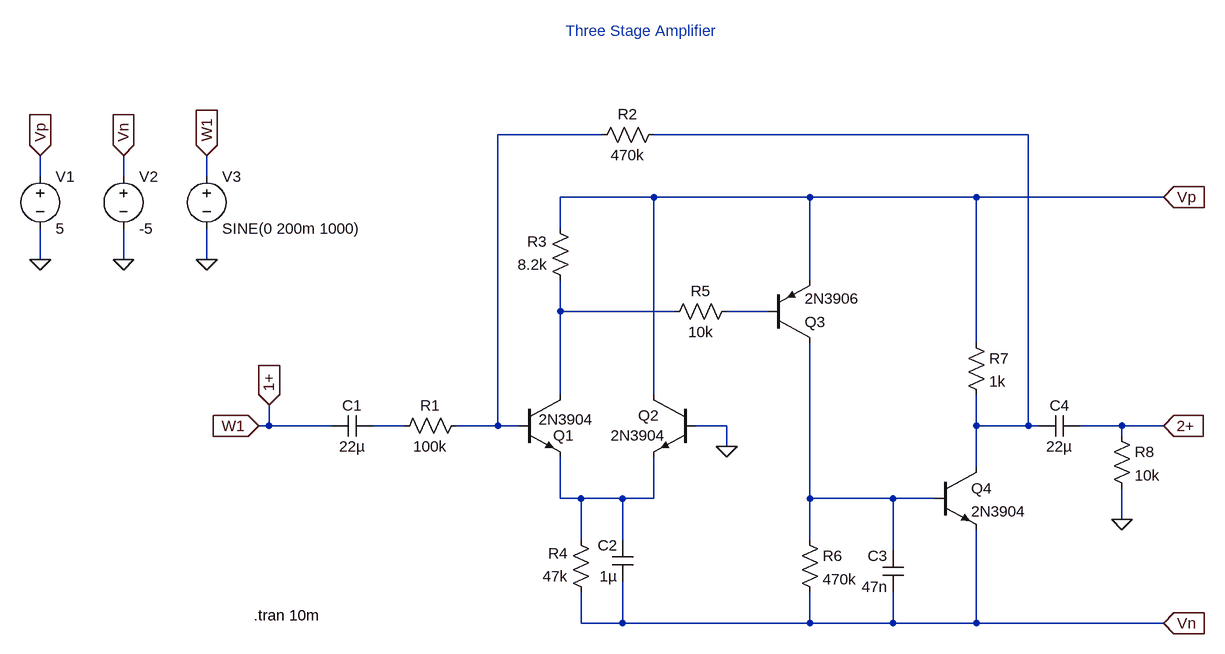
[diagram p0: schematic three_stage_amp_ltspice.asc]
three_stage_amp_ltspice.asc, the LTspice schematic file:
Version 4
SHEET 1 1400 680
WIRE 288 -320 128 -320
WIRE 944 -320 368 -320
WIRE -576 -256 -576 -288
WIRE -448 -256 -448 -288
WIRE -320 -256 -320 -288
WIRE 368 -224 224 -224
WIRE 608 -224 368 -224
WIRE 864 -224 608 -224
WIRE 1152 -224 864 -224
WIRE 224 -176 224 -224
WIRE -576 -128 -576 -176
WIRE -448 -128 -448 -176
WIRE -320 -128 -320 -176
WIRE 608 -96 608 -224
WIRE 224 -48 224 -96
WIRE 400 -48 224 -48
WIRE 544 -48 480 -48
WIRE 864 0 864 -224
WIRE 224 80 224 -48
WIRE 368 80 368 -224
WIRE -224 128 -224 96
WIRE -224 128 -240 128
WIRE -128 128 -224 128
WIRE -16 128 -64 128
WIRE 128 128 128 -320
WIRE 128 128 64 128
WIRE 160 128 128 128
WIRE 480 128 432 128
WIRE 864 128 864 80
WIRE 944 128 944 -320
WIRE 944 128 864 128
WIRE 960 128 944 128
WIRE 1088 128 1024 128
WIRE 1152 128 1088 128
WIRE 1088 144 1088 128
WIRE 480 160 480 128
WIRE 864 192 864 128
WIRE 224 240 224 176
WIRE 256 240 224 240
WIRE 320 240 256 240
WIRE 368 240 368 176
WIRE 368 240 320 240
WIRE 608 240 608 0
WIRE 736 240 608 240
WIRE 800 240 736 240
WIRE 1088 272 1088 224
WIRE 256 304 256 240
WIRE 320 304 320 240
WIRE 608 304 608 240
WIRE 736 320 736 240
WIRE 256 432 256 384
WIRE 320 432 320 368
WIRE 320 432 256 432
WIRE 608 432 608 384
WIRE 608 432 320 432
WIRE 736 432 736 384
WIRE 736 432 608 432
WIRE 864 432 864 288
WIRE 864 432 736 432
WIRE 1152 432 864 432
FLAG 480 160 0
FLAG 1088 272 0
FLAG -240 128 W1
IOPIN -240 128 In
FLAG 1152 -224 Vp
IOPIN 1152 -224 In
FLAG 1152 128 2+
IOPIN 1152 128 In
FLAG 1152 432 Vn
IOPIN 1152 432 In
FLAG -224 96 1+
IOPIN -224 96 In
FLAG -576 -128 0
FLAG -448 -128 0
FLAG -320 -128 0
FLAG -320 -288 W1
IOPIN -320 -288 In
FLAG -448 -288 Vn
IOPIN -448 -288 In
FLAG -576 -288 Vp
IOPIN -576 -288 In
SYMBOL npn 160 80 R0
WINDOW 0 53 63 Left 2
WINDOW 3 31 38 Left 2
SYMATTR InstName Q1
SYMATTR Value 2N3904
SYMBOL npn 432 80 M0
WINDOW 3 46 63 Left 2
SYMATTR InstName Q2
SYMATTR Value 2N3904
SYMBOL pnp 544 0 M180
SYMATTR InstName Q3
SYMATTR Value 2N3906
SYMBOL npn 800 192 R0
SYMATTR InstName Q4
SYMATTR Value 2N3904
SYMBOL res 80 112 R90
WINDOW 0 0 56 VBottom 2
WINDOW 3 32 56 VTop 2
SYMATTR InstName R1
SYMATTR Value 100k
SYMBOL res 384 -336 R90
WINDOW 0 0 56 VBottom 2
WINDOW 3 32 56 VTop 2
SYMATTR InstName R2
SYMATTR Value 470k
SYMBOL res 240 -80 R180
WINDOW 0 36 76 Left 2
WINDOW 3 36 40 Left 2
SYMATTR InstName R3
SYMATTR Value 8.2k
SYMBOL res 272 400 R180
WINDOW 0 36 76 Left 2
WINDOW 3 36 40 Left 2
SYMATTR InstName R4
SYMATTR Value 47k
SYMBOL res 384 -32 R270
WINDOW 0 32 56 VTop 2
WINDOW 3 0 56 VBottom 2
SYMATTR InstName R5
SYMATTR Value 10k
SYMBOL res 592 288 R0
SYMATTR InstName R6
SYMATTR Value 470k
SYMBOL res 848 -16 R0
SYMATTR InstName R7
SYMATTR Value 1k
SYMBOL res 1072 128 R0
SYMATTR InstName R8
SYMATTR Value 10k
SYMBOL cap -64 112 R90
WINDOW 0 0 32 VBottom 2
WINDOW 3 32 32 VTop 2
SYMATTR InstName C1
SYMATTR Value 22µ
SYMBOL cap 336 368 R180
WINDOW 0 24 56 Left 2
WINDOW 3 24 8 Left 2
SYMATTR InstName C2
SYMATTR Value 1µ
SYMBOL cap 752 384 R180
WINDOW 0 24 56 Left 2
WINDOW 3 24 8 Left 2
SYMATTR InstName C3
SYMATTR Value 47n
SYMBOL cap 960 144 R270
WINDOW 0 32 32 VTop 2
WINDOW 3 0 32 VBottom 2
SYMATTR InstName C4
SYMATTR Value 22µ
SYMBOL voltage -576 -272 R0
WINDOW 123 0 0 Left 0
WINDOW 39 0 0 Left 0
SYMATTR InstName V1
SYMATTR Value 5
SYMBOL voltage -448 -272 R0
WINDOW 123 0 0 Left 0
WINDOW 39 0 0 Left 0
SYMATTR InstName V2
SYMATTR Value -5
SYMBOL voltage -320 -272 R0
WINDOW 123 0 0 Left 0
WINDOW 39 0 0 Left 0
SYMATTR InstName V3
SYMATTR Value SINE(0 200m 1000)
TEXT -248 420 Left 2 !.tran 10m
TEXT 232 -480 Left 2 ;Three Stage Amplifier

The netlist it stands for:
* three_stage_amp_ltspice.asc
Q1 N003 N001 N006 0 2N3904
Q2 Vp 0 N006 0 2N3904
Q3 N007 N004 Vp 0 2N3906
Q4 N002 N007 Vn 0 2N3904
R1 N001 N005 100k
R2 N002 N001 470k
R3 N003 Vp 8.2k
R4 Vn N006 47k
R5 N003 N004 10k
R6 N007 Vn 470k
R7 Vp N002 1k
R8 2+ 0 10k
C1 N005 1+ 22µ
C2 Vn N006 1µ
C3 Vn N007 47n
C4 N002 2+ 22µ
V1 Vp 0 5
V2 Vn 0 -5
V3 1+ 0 SINE(0 200m 1000)
.model NPN NPN
.model PNP PNP
.lib standard.bjt
.tran 10m
* Three Stage Amplifier
.backanno
.end